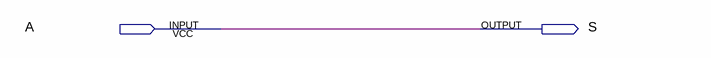
[diagram p0: schematic sheet]
// Quartus schematic E_S.bdf as structural Verilog: 0 symbols, 2 pins
module E_S (
  input  A,
  output S
);


  assign S = A;
endmodule
